# EAGLE schematic OBKP_Effector_PCB_MIKE_DID_IT (EAGLE 6.4)
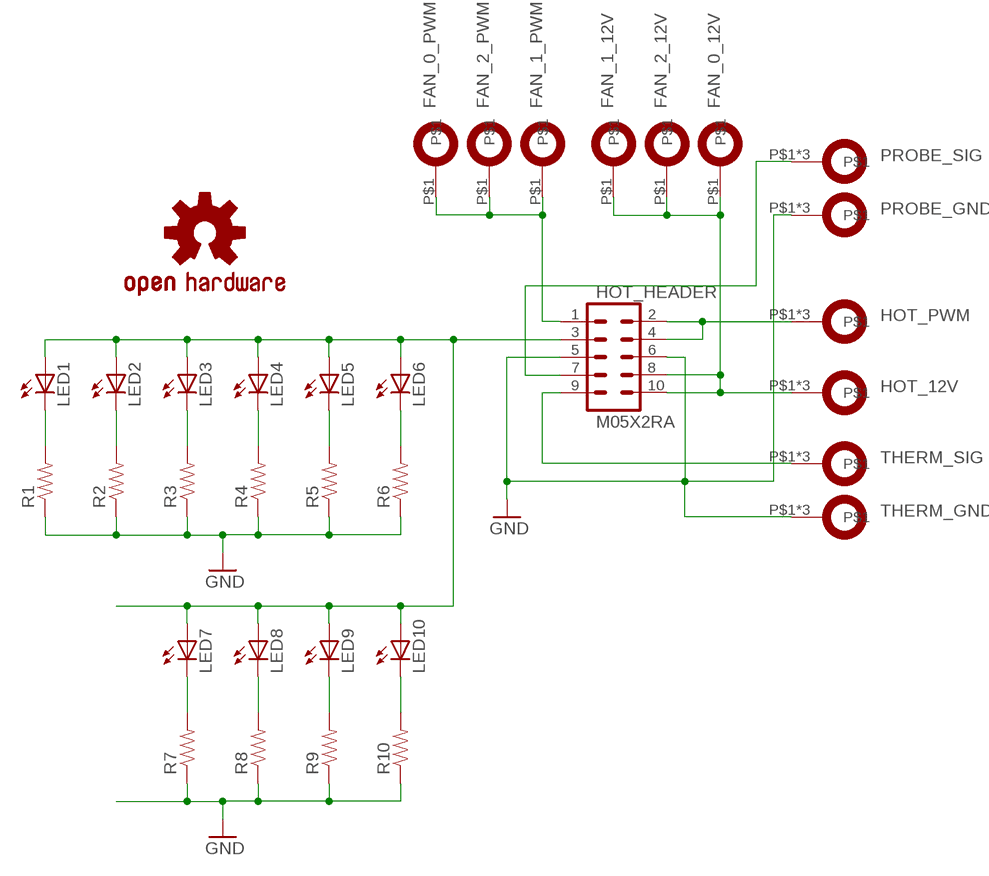
[diagram p0: schematic, sheet 1]

## Parts
FAN_0_12V  LUG2.3  [2.3MM]
FAN_0_PWM  LUG2.3  [2.3MM]
FAN_1_12V  LUG2.3  [2.3MM]
FAN_1_PWM  LUG2.3  [2.3MM]
FAN_2_12V  LUG2.3  [2.3MM]
FAN_2_PWM  LUG2.3  [2.3MM]
HOT_12V  LUG3-X  [3MM]
HOT_HEADER  M05X2RA  [2X5-RA]
HOT_PWM  LUG3-X  [3MM]
LED1  LED0805  [CHIPLED_0805]
LED2  LED0805  [CHIPLED_0805]
LED3  LED0805  [CHIPLED_0805]
LED4  LED0805  [CHIPLED_0805]
LED5  LED0805  [CHIPLED_0805]
LED6  LED0805  [CHIPLED_0805]
LED7  LED0805  [CHIPLED_0805]
LED8  LED0805  [CHIPLED_0805]
LED9  LED0805  [CHIPLED_0805]
LED10  LED0805  [CHIPLED_0805]
LOGO1  OSHW-LOGOS  [OSHW-LOGO-S]
PROBE_GND  LUG3-X  [3MM]
PROBE_SIG  LUG3-X  [3MM]
R1  RESISTOR0805-RES  [0805]
R2  RESISTOR0805-RES  [0805]
R3  RESISTOR0805-RES  [0805]
R4  RESISTOR0805-RES  [0805]
R5  RESISTOR0805-RES  [0805]
R6  RESISTOR0805-RES  [0805]
R7  RESISTOR0805-RES  [0805]
R8  RESISTOR0805-RES  [0805]
R9  RESISTOR0805-RES  [0805]
R10  RESISTOR0805-RES  [0805]
THERM_GND  LUG3-X  [3MM]
THERM_SIG  LUG3-X  [3MM]

## Nets
FAN_VCC: HOT_HEADER.3 LED1.A LED2.A LED3.A LED4.A LED5.A LED6.A LED7.A LED8.A LED9.A LED10.A
GND: HOT_HEADER.5 HOT_HEADER.6 PROBE_GND.P$1 PROBE_GND.P$2 PROBE_GND.P$3 R1.1 R2.1 R3.1 R4.1 R5.1 R6.1 R7.1 R8.1 R9.1 R10.1 THERM_GND.P$1 THERM_GND.P$2 THERM_GND.P$3
N$1: LED1.C R1.2
N$2: LED2.C R2.2
N$3: LED3.C R3.2
N$4: LED4.C R4.2
N$5: LED5.C R5.2
N$6: LED6.C R6.2
N$7: LED7.C R7.2
N$9: LED8.C R8.2
N$10: FAN_0_12V.P$1 FAN_1_12V.P$1 FAN_2_12V.P$1 HOT_12V.P$1 HOT_12V.P$2 HOT_12V.P$3 HOT_HEADER.8 HOT_HEADER.10
N$11: HOT_HEADER.9 THERM_SIG.P$1 THERM_SIG.P$2 THERM_SIG.P$3
N$12: HOT_HEADER.7 PROBE_SIG.P$1 PROBE_SIG.P$2 PROBE_SIG.P$3
N$13: LED9.C R9.2
N$14: LED10.C R10.2
N$15: HOT_HEADER.2 HOT_HEADER.4 HOT_PWM.P$1 HOT_PWM.P$2 HOT_PWM.P$3
N$17: FAN_0_PWM.P$1 FAN_1_PWM.P$1 FAN_2_PWM.P$1 HOT_HEADER.1

## Library data of the parts
FAN_0_12V FAN_0_PWM FAN_1_12V FAN_1_PWM FAN_2_12V FAN_2_PWM HOT_12V HOT_PWM PROBE_GND PROBE_SIG THERM_GND THERM_SIG = OBKP_Effector_PCB:LUG
HOT_HEADER = SparkFun-Connectors:M05X2: Header 5x2 Standard 10-pin dual row 0.1" header. Commonly used with AVR-ISP. Use with Spark Fun Electronics SKU: PRT-00778
LED1-LED10 = SparkFun-LED:LED: LEDs Standard schematic elements and footprints for 5mm, 3mm, 1206, and 0603 sized LEDs. 5mm - Spark Fun Electronics SKU : COM-00529 (and others)
LOGO1 = SparkFun-Aesthetics:OSHW-LOGO: Open Source Hardware Logo This logo indicates the piece of hardware it is found on incorporates a OSHW license and/or adheres to the definition of open source hardware found here: http://freedomdefined.org/OSHW
R1-R10 = SparkFun-Passives:RESISTOR: Resistor Basic schematic elements and footprints for 0603, 1206, and PTH resistors.

## Net classes
0 default: width 0.203 mm, drill 0.305 mm, clearance 0.203 mm
1 high current: width 0.762 mm, drill 0.457 mm, clearance 0.203 mm